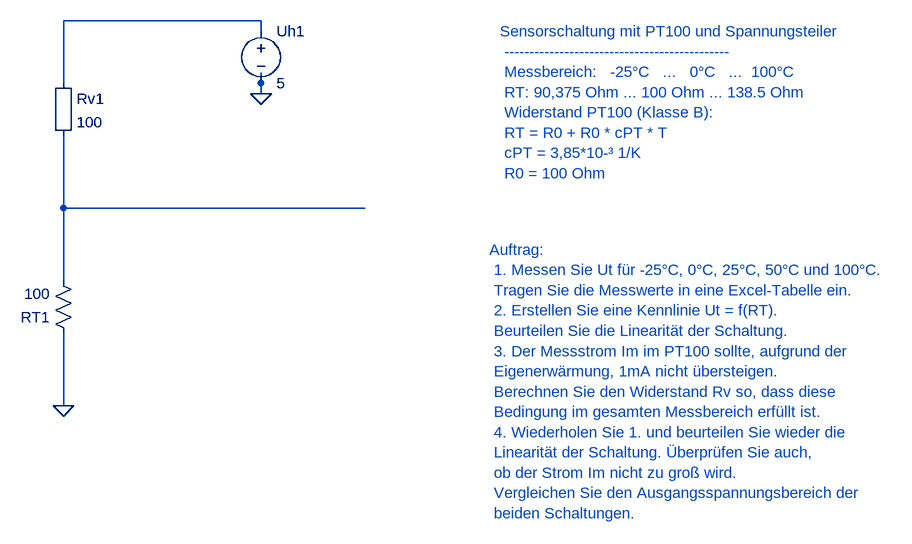
[diagram p0: schematic 1_1_PT100-Sensor_Spannungsteiler.asc]
1_1_PT100-Sensor_Spannungsteiler.asc, the LTspice schematic file:
Version 4
SHEET 1 880 680
WIRE 400 240 400 224
WIRE 400 224 400 256
WIRE 400 160 400 144
WIRE 400 144 96 144
WIRE 96 144 96 240
WIRE 96 320 96 432
WIRE 96 432 560 432
WIRE 96 544 96 432
WIRE 96 624 96 736
FLAG 400 256 0
FLAG 96 736 0
FLAG 400 256 0
FLAG 96 736 0
SYMBOL res 112 640 R180
SYMATTR InstName RT1
SYMATTR Value 100
SYMBOL voltage 400 144 R0
SYMATTR InstName Uh1
SYMATTR Value 5
SYMBOL Misc\EuropeanResistor 80 224 R0
SYMATTR InstName Rv1
SYMATTR Value 100
TEXT 768 160 Left 2 ;Sensorschaltung mit PT100 und Spannungsteiler \n --------------------------------------------- \n Messbereich:   -25°C   ...   0°C   ...  100°C \n RT: 90,375 Ohm ... 100 Ohm ... 138.5 Ohm \n Widerstand PT100 (Klasse B): \n RT = R0 + R0 * cPT * T \n cPT = 3,85*10-³ 1/K \n R0 = 100 Ohm
TEXT 752 496 Left 2 ;Auftrag: \n 1. Messen Sie Ut für -25°C, 0°C, 25°C, 50°C und 100°C. \n Tragen Sie die Messwerte in eine Excel-Tabelle ein. \n 2. Erstellen Sie eine Kennlinie Ut = f(RT). \n Beurteilen Sie die Linearität der Schaltung. \n 3. Der Messstrom Im im PT100 sollte, aufgrund der \n Eigenerwärmung, 1mA nicht übersteigen. \n Berechnen Sie den Widerstand Rv so, dass diese \n Bedingung im gesamten Messbereich erfüllt ist. \n 4. Wiederholen Sie 1. und beurteilen Sie wieder die \n Linearität der Schaltung. Überprüfen Sie auch, \n ob der Strom Im nicht zu groß wird. \n Vergleichen Sie den Ausgangsspannungsbereich der \n beiden Schaltungen.

The netlist it stands for:
* 1_1_PT100-Sensor_Spannungsteiler.asc
RT1 0 N002 100
V§Uh1 N001 0 5
Rv1 N001 N002 100
* Sensorschaltung mit PT100 und Spannungsteiler
*  ---------------------------------------------
*  Messbereich:   -25°C   ...   0°C   ...  100°C
*  RT: 90,375 Ohm ... 100 Ohm ... 138.5 Ohm
*  Widerstand PT100 (Klasse B):
*  RT = R0 + R0 * cPT * T
*  cPT = 3,85*10-³ 1/K
*  R0 = 100 Ohm
* Auftrag:
*  1. Messen Sie Ut für -25°C, 0°C, 25°C, 50°C und 100°C.
*  Tragen Sie die Messwerte in eine Excel-Tabelle ein.
*  2. Erstellen Sie eine Kennlinie Ut = f(RT).
*  Beurteilen Sie die Linearität der Schaltung.
*  3. Der Messstrom Im im PT100 sollte, aufgrund der
*  Eigenerwärmung, 1mA nicht übersteigen.
*  Berechnen Sie den Widerstand Rv so, dass diese
*  Bedingung im gesamten Messbereich erfüllt ist.
*  4. Wiederholen Sie 1. und beurteilen Sie wieder die
*  Linearität der Schaltung. Überprüfen Sie auch,
*  ob der Strom Im nicht zu groß wird.
*  Vergleichen Sie den Ausgangsspannungsbereich der
*  beiden Schaltungen.
.backanno
.end